# Altium schematic sheet CPC1014_RELAY.SchDoc
size A4
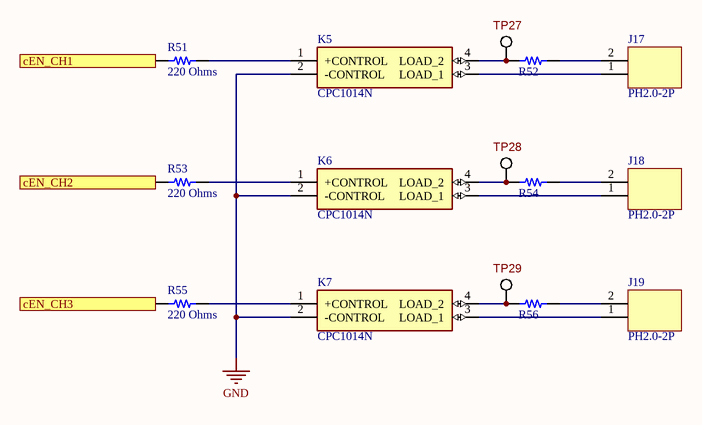
[diagram p0: CPC1014_RELAY.SchDoc]

## Parts
J17  PH2.0-2P  [PH2.0-2P]
J18  PH2.0-2P  [PH2.0-2P]
J19  PH2.0-2P  [PH2.0-2P]
K5  CPC1014N  [SOP254P610X218-4N]
K6  CPC1014N  [SOP254P610X218-4N]
K7  CPC1014N  [SOP254P610X218-4N]
R51  220 Ohms  [RES 0805_2012]
R52  (no value)  [RES 0805_2012]
R53  220 Ohms  [RES 0805_2012]
R54  (no value)  [RES 0805_2012]
R55  220 Ohms  [RES 0805_2012]
R56  (no value)  [RES 0805_2012]
TP27  PAD-1.1mm  [PAD-1.1mm]  (value not drawn)  (no BOM)
TP28  PAD-1.1mm  [PAD-1.1mm]  (value not drawn)  (no BOM)
TP29  PAD-1.1mm  [PAD-1.1mm]  (value not drawn)  (no BOM)

## Ports
cEN_CH1, cEN_CH2, cEN_CH3

## Nets
GND: K5.2(-CONTROL) K6.2(-CONTROL) K7.2(-CONTROL)
cEN_CH1: R51.2 ; port cEN_CH1
cEN_CH2: R53.2 ; port cEN_CH2
cEN_CH3: R55.2 ; port cEN_CH3
NetJ17_1: J17.1 K5.3(LOAD_1)
NetJ17_2: J17.2 R52.2
NetJ18_1: J18.1 K6.3(LOAD_1)
NetJ18_2: J18.2 R54.2
NetJ19_1: J19.1 K7.3(LOAD_1)
NetJ19_2: J19.2 R56.2
NetK5_1: K5.1(+CONTROL) R51.1
NetK5_4: K5.4(LOAD_2) R52.1 TP27.1
NetK6_1: K6.1(+CONTROL) R53.1
NetK6_4: K6.4(LOAD_2) R54.1 TP28.1
NetK7_1: K7.1(+CONTROL) R55.1
NetK7_4: K7.4(LOAD_2) R56.1 TP29.1

## Library data of the parts
K5-K7 = CPC1014N: Relay or Contactor; Manufacturer_Name: LITTELFUSE; Datasheet Link: https://datasheet.datasheetarchive.com/originals/distributors/Datasheets-DGA15/691004.pdf; Height: 2.184mm; Manufacturer_Part_Number: CPC1014N; Mouser Part Number: 849-CPC1014N; Mouser Price/Stock: https://www.mouser.co.uk/ProductDetail/IXYS-Integrated-Circuits/CPC1014N?qs=OpMkDkHXivPNK7%252BhCXwefA%3D%3D; Arrow Part Number: CPC1014N; Arrow Price/Stock: https://www.arrow.com/en/products/cpc1014n/ixys
R51 R53 R55 = ESR10EZPF2200: RES SMD 220 OHM 1% 0.4W 0805; Manufacturer: Rohm Semiconductor; Power (Watts): 0.4W, 2/5W; Temperature Coefficient: ±100ppm/°C; Part Number: ESR10EZPF2200; Value: 220 Ohms; ComponentLink1Description: Datasheet; ComponentLink1URL: https://www.rohm.com/datasheet/ESR01MZPF/esr-e; ComponentLink2Description: DigiKey Link; ComponentLink2URL: http://digikey.com/product-detail/en/rohm-semiconductor/ESR10EZPF2200/RHM220AECT-ND/1983835; Composition: Thick Film; Device Package: 0805 (2012 Metric); Features: Automotive AEC-Q200, Pulse Withstanding; Height - Seated (Max): 0.026" (0.65mm); LastUpdated: 02.09.2020 01:15:23; Lifecycle Status: Active; Minimum Order: 1; Number of Terminations: 2; Operating Temperature: -55°C ~ 155°C; Package / Case: 0805 (2012 Metric); Packaging: TapeAndReel; PartId: 28037; Part Status: Active; Price: 0.02; Ratings: AEC-Q200; Resistance: 220 Ohms; Series: ESR; Size / Dimension: 0.079" L x 0.049" W (2.00mm x 1.25mm); Supplier 1: DigiKey; Supplier Part Number 1: RHM220AECT-ND; Supplier Device Package: 0805; Tolerance: ±1%
R52 R54 R56 = RC0805JR-070RP: RES SMD 0 OHM JUMPER 1/8W 0805; Manufacturer: Yageo; Power (Watts): 0.125W, 1/8W; Part Number: RC0805JR-070RP; ComponentLink1Description: Datasheet; ComponentLink1URL: http://www.yageo.com/NewPortal/yageodocoutput?fileName=/pdf/R-Chip/PYu-RC_51_RoHS_P_0.pdf; ComponentLink2Description: DigiKey Link; ComponentLink2URL: http://digikey.com/product-detail/en/yageo/RC0805JR-070RP/YAG1327CT-ND/4935440; Composition: Thick Film; Device Package: 0805 (2012 Metric); Features: Moisture Resistant; Height - Seated (Max): 0.024" (0.60mm); LastUpdated: 02.09.2020 01:15:23; Lifecycle Status: Active; Minimum Order: 1; Number of Terminations: 2; Operating Temperature: -55°C ~ 155°C; Package / Case: 0805 (2012 Metric); Packaging: TapeAndReel; PartId: 28121; Part Status: Active; Price: 0.01; Series: RC-P Lead Free; Size / Dimension: 0.079" L x 0.049" W (2.00mm x 1.25mm); Supplier 1: DigiKey; Supplier Part Number 1: YAG1327CT-ND; Supplier Device Package: 0805; Tolerance: Jumper
TP27-TP29 = PAD-1.1mm: 1.1mm Pad for Plug-In or Receptacle; Ajax_1C_PN: NONE; Ajax_1С_Status: RND Only; Component Status: Released; Lifecycle: ="Lifecycle"; Part Number: PAD-1.1mm; Component Type: PTH; Manufacturer: NONE; Part Type: Pad; Temperature Range: NONE; ComponentLink1URL: NONE; Replacement: NONE; Price: NONE; ComponentLink1Description: Datasheet